# EAGLE schematic triacBoard (EAGLE 7.2.0)
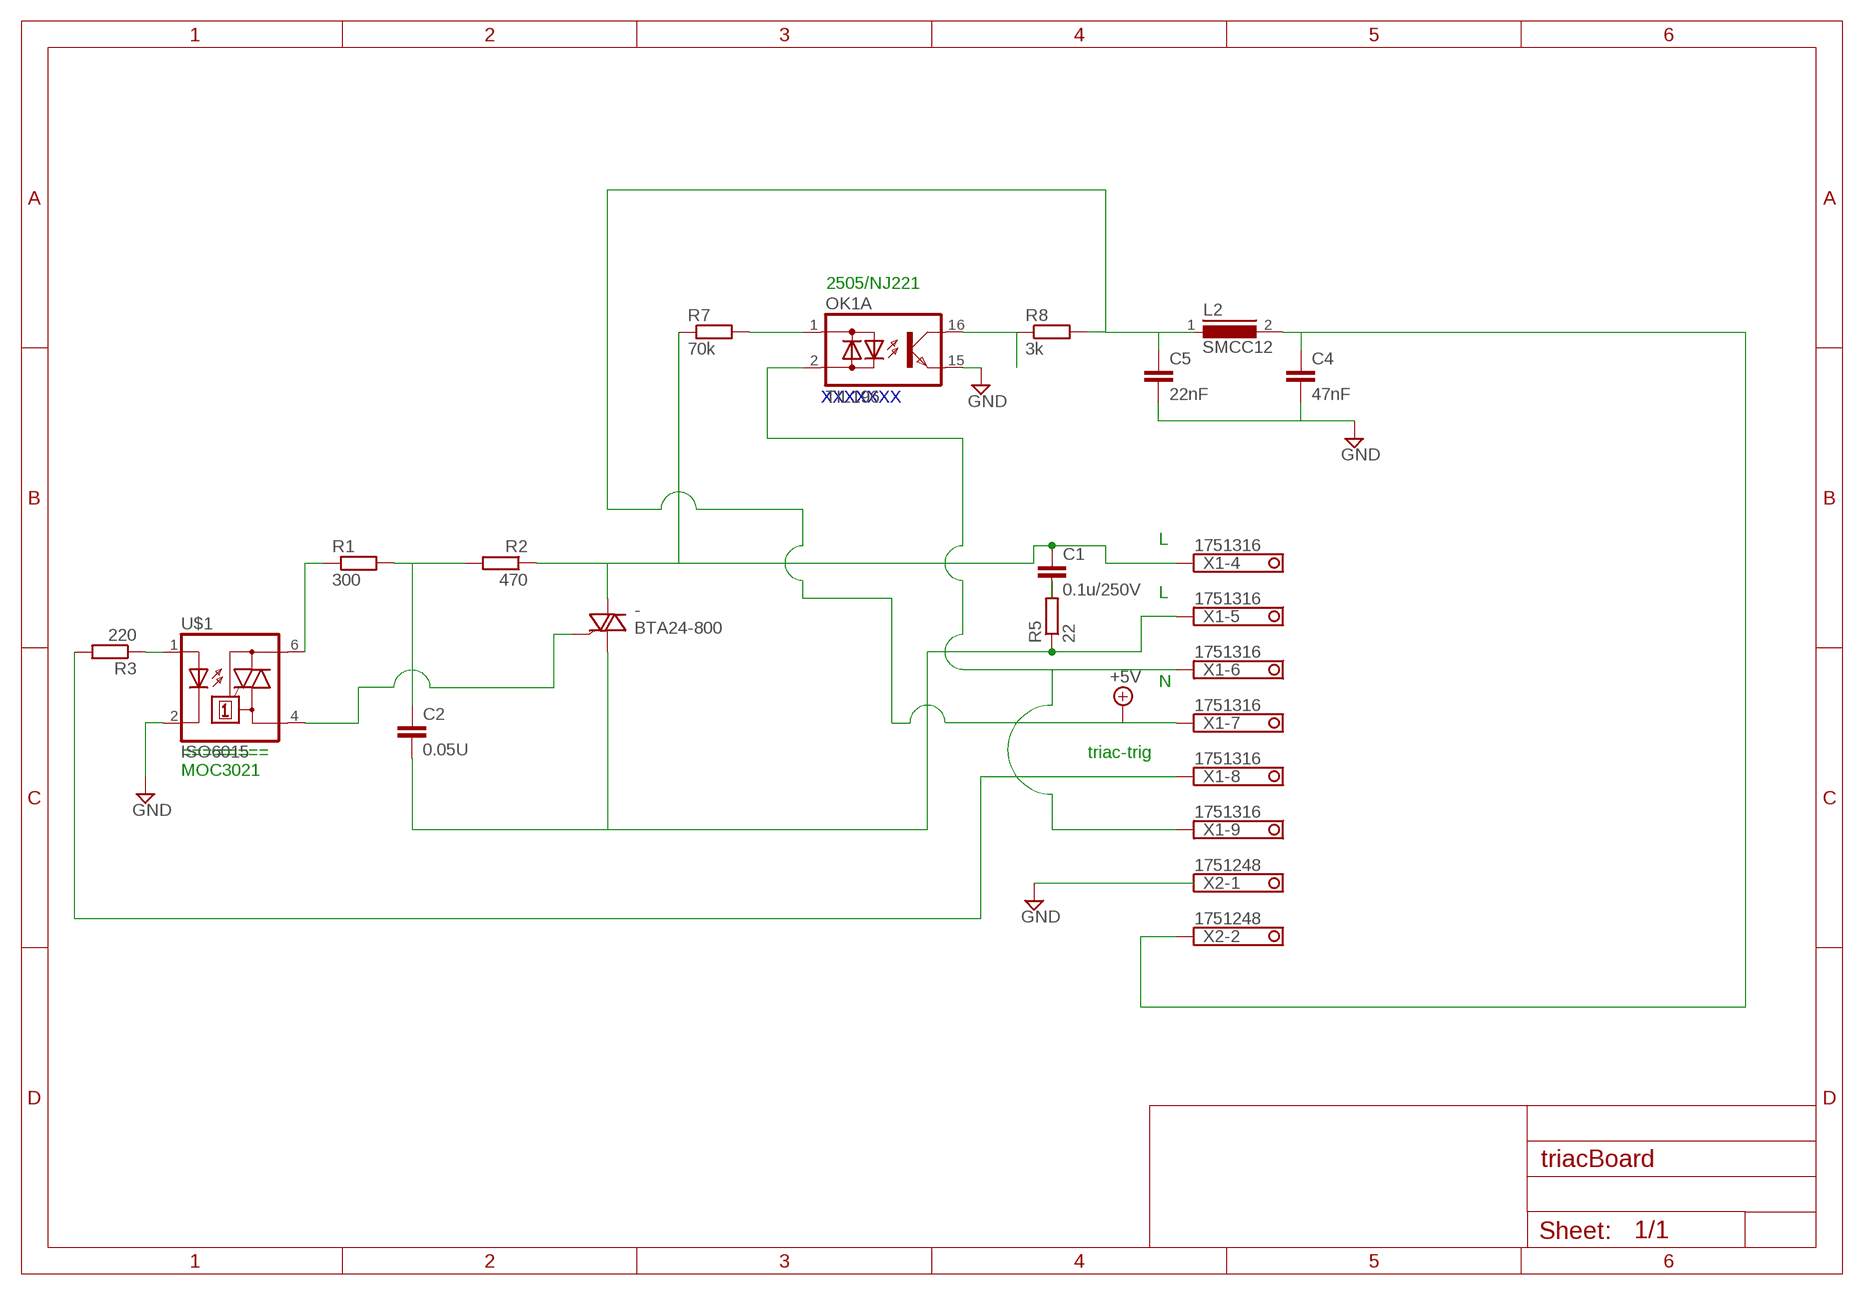
[diagram p0: schematic, sheet 1]

## Parts
-  BTA24-800  [TO220CLK]
C1  0.1u/250V  C5/5  [C5B5]
C2  0.05U  C-EU025-040X050  [C025-040X050]
C4  47nF  C-EU050-030X075  [C050-030X075]
C5  22nF  C-EU050-030X075  [C050-030X075]
L2  SMCC12  [SMCC12]
OK1  TIL196  [DIL16]
R1  300  R-EU_0207/15  [0207/15]
R2  470  R-EU_0207/15  [0207/15]
R3  220  R-EU_0207/15  [0207/15]
R5  22  R-EU_0309/12  [0309/12]
R7  70k  R-EU_0207/15  [0207/15]
R8  3k  R-EU_0207/15  [0207/15]
U$1  ISO6015  [DIL06]
X1  1751316  [1751316]
X2  1751248  [1751248]

## Nets
+5V: R8.2 X1.7
GND: C4.2 C5.2 OK1.15(A:E) U$1.2(C)
N$1: OK1.1(A:AC1) R7.2
N$2: C2.2 R5.1 X1.5
N$3: OK1.16(A:C) R8.1
N$4: -.G
N$5: C2.1 R1.2 R2.2
N$6: R3.2 X1.8
N$7: R1.1 U$1.6(A2)
N$8: C1.2 R5.2
N$9: -.A(A1)
N$10: -.C(A2) C1.1 R2.1 R7.1 X1.4
N$12: U$1.4(A1)
N$13: R3.1 U$1.1(A)
N$21: OK1.2(A:AC2) X1.6 X1.9
N$34: C4.1 L2.2 X2.2
N$35: C5.1 L2.1
Unconnected: OK1.3(B:AC1) OK1.4(B:AC2) OK1.5(C:AC1) OK1.6(C:AC2) OK1.7(D:AC1) OK1.8(D:AC2) OK1.9(D:E) OK1.10(D:C) OK1.11(C:E) OK1.12(C:C) OK1.13(B:E) OK1.14(B:C) X1.1 X1.2 X1.3 X2.1

## Notes on the sheet
- 2505/NJ221
- XXXXXXX
- L
- L
- N
- ===== | ===== | triac-trig
- MOC3021

## Library data of the parts
- = triac:BTA24-800
C1 = capacitor-wima:C: CAPACITOR naming: grid - package width
C2 C4 C5 = resistor:C-EU: CAPACITOR, European symbol
L2 = inductors:SMCC12: INDUCTOR
OK1 = optocoupler:TIL196: TEXAS INSTRUMENTS OPTO COUPLER; MPN: TIL 196; OC_FARNELL: 1683367; OC_NEWARK: 05R6476
R1-R3 R5 R7 R8 = resistor:R-EU_: RESISTOR, European symbol
U$1 = optocoupler:ISO6015
X1 = con-phoenix-350:1751316: MKDS 1/ 9-3,5 Printklemme Nennstrom: 10 A Bemessungsspannung: 160 V Raster: 3,5 mm Polzahl: 9 Montageart: Löten Anschlussart: Schraubanschluss Anschlussrichtung vom Leiter zur Platine: 0° Source: http://eshop.phoenixcontact.com .. 1751316.pdf
X2 = con-phoenix-350:1751248: MKDS 1/ 2-3,5 Printklemme Nennstrom: 10 A Bemessungsspannung: 160 V Raster: 3,5 mm Polzahl: 2 Montageart: Löten Anschlussart: Schraubanschluss Anschlussrichtung vom Leiter zur Platine: 0° Source: http://eshop.phoenixcontact.com .. 1751248.pdf